# Altium schematic sheet ESP8266_Impedance.SchDoc
size A
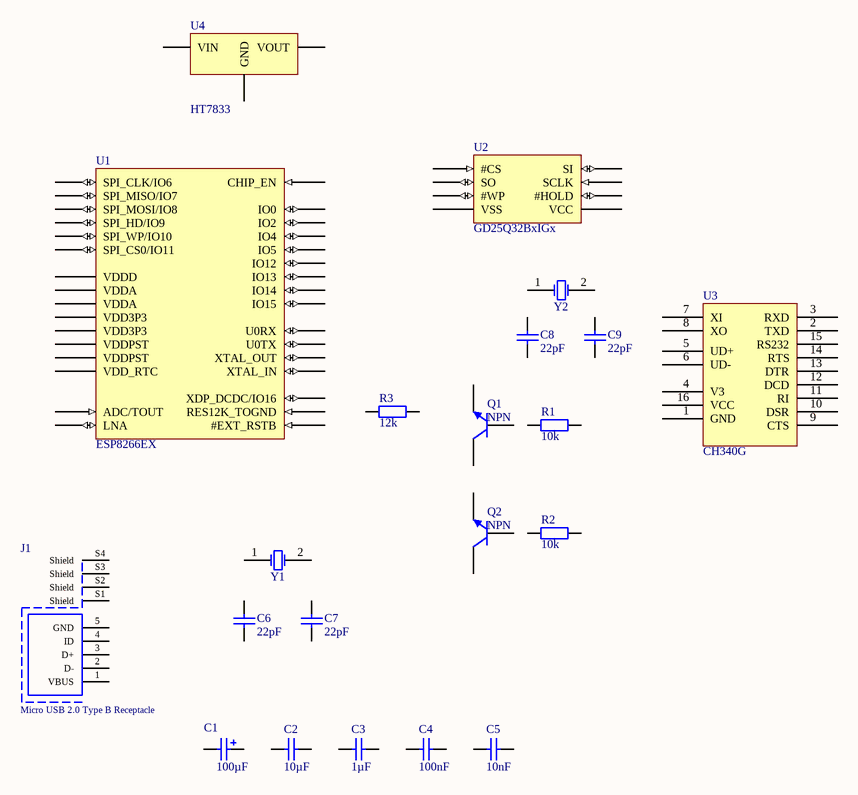
[diagram p0: ESP8266_Impedance.SchDoc]

## Parts
C1  100µF  [WCAP-ATG8_5x11]
C2  10µF  [WCAP-CSGP_0805_H=0.8mm_Reflow]
C3  1µF  [WCAP-CSGP_0805_H=0.8mm_Reflow]
C4  100nF  [WCAP-CSGP_0805_H=0.8mm_Reflow]
C5  10nF  [WCAP-CSGP_0805_H=0.8mm_Reflow]
C6  22pF  [WCAP-CSGP_0805_H=0.8mm_Reflow]
C7  22pF  [WCAP-CSGP_0805_H=0.8mm_Reflow]
C8  22pF  [WCAP-CSGP_0805_H=0.8mm_Reflow]
C9  22pF  [WCAP-CSGP_0805_H=0.8mm_Reflow]
J1  Micro USB 2.0 Type B Receptacle  [629105136821]
Q1  NPN  [SOT23P250X110-3N]
Q2  NPN  [SOT23P250X110-3N]
R1  10k  [WRIS-PSMB_0805_H=0.22mm]
R2  10k  [WRIS-PSMB_0805_H=0.22mm]
R3  12k  [WRIS-PSMB_0805_H=0.22mm]
U1  ESP8266EX  [ESP8266EX]
U2  GD25Q32BxIGx  [GD25Q32BxIGx]
U3  CH340G  [CH340G]
U4  HT7833  [HT7833]
Y1  24MHz  [WE-XTAL_HC49/4H]  (value not drawn)
Y2  12MHz  [WE-XTAL_HC49/4H]  (value not drawn)

## Nets

Not connected (* = marked no-connect by the designer): C1 1(N) 2(P); C2 1 2; C3 1 2; C4 1 2; C5 1 2; C6 1 2; C7 1 2; C8 1 2; C9 1 2; J1 1(VBUS) 2(D-) 3(D+) 4(ID) 5(GND) S1(Shield) S2(Shield) S3(Shield) S4(Shield); Q1 1(C) 2(B) 3(E); Q2 1(C) 2(B) 3(E); R1 1 2; R2 1 2; R3 1 2; U1 1(VDDA) 2(LNA) 3(VDD3P3) 4(VDD3P3) 5(VDD_RTC) 6(ADC/TOUT) 7(CHIP_EN) 8(XDP_DCDC/IO16) 9(IO14) 10(IO12) 11(VDDPST) 12(IO13) 13(IO15) 14(IO2) 15(IO0) 16(IO4) 17(VDDPST) 18(SPI_HD/IO9) 19(SPI_WP/IO10) 20(SPI_CS0/IO11) 21(SPI_CLK/IO6) 22(SPI_MISO/IO7) 23(SPI_MOSI/IO8) 24(IO5) 25(U0RX) 26(U0TX) 27(XTAL_OUT) 28(XTAL_IN) 29(VDDD) 30(VDDA) 31(RES12K_TOGND) 32(#EXT_RSTB); U2 1(#CS) 2(SO) 3(#WP) 4(VSS) 5(SI) 6(SCLK) 7(#HOLD) 8(VCC); U3 1(GND) 2(TXD) 3(RXD) 4(V3) 5(UD+) 6(UD-) 7(XI) 8(XO) 9(CTS) 10(DSR) 11(RI) 12(DCD) 13(DTR) 14(RTS) 15(RS232) 16(VCC); U4 1(GND) 2(VIN) 3(VOUT); Y1 1(OSC1) 2(OSC2); Y2 1(OSC1) 2(OSC2)

## Library data of the parts
C1 = 860010272005: WCAP-ATG8 THT Aluminum Electrolytic Capacitors, D5mm x L11mm, 100uF, +/-20%, 10VDC; Dissipation Factor: 19%; Endurance: 2000h; Leakage Current: 10uA; Ripple Current max.: 198mA; Technical Reference: ATBC110101M010DSPA3B000; ComponentLink1Description: Manufacturer; ComponentLink1URL: http://www.we-online.de; ComponentLink2Description: Datasheet; ComponentLink2URL: https://katalog.we-online.com/pbs/datasheet/860010272005.pdf; Length: 11mm; Mounting Technology: THT; Operating Temperature: -40 to +85degC; Packaging: Ammo Pack; Published Date: August 2019; Capacitance: 100uF; Diameter: 5mm; Part Number: 860010272005; Publisher: Wurth Elektronik; Capacitance Tolerance: +/-20%; Rated Voltage: 10VDC
C2-C9 = 885012007007: WCAP-CSGP General Purpose Ceramic Capacitors, size 0805, 470pF, +/-5%, 10VDC; Isolation Resistance: >=10GOhm; Ceramic Type: NP0; Dissipation Factor: Q>=1000; Technical Reference: NP00805471J010DFCT10000; ComponentLink1Description: Manufacturer; ComponentLink1URL: http://www.we-online.de; ComponentLink2Description: Datasheet; ComponentLink2URL: https://katalog.we-online.com/pbs/datasheet/885012007007.pdf; Operating Temperature: -55 to +125degC; Packaging: Tape and Reel; Part Number: 885012007007; Publisher: Wurth Elektronik; Rated Voltage: 10VDC; Published Date: August 2019; Capacitance Tolerance: +/-5%; Height: 0.8mm +/-0.10mm; Mounting Technology: SMD; Size: 0805; Capacitance: 470pF
J1 = 629105136821: Micro USB 2.0 Type B, Receptacle, Horizontal, SMT; Rated Current: 1A; Pin Number: 5; Interface Type: Type B; Working Voltage: 30VAC; ComponentLink1Description: Manufacturer; ComponentLink1URL: http://www.we-online.de; ComponentLink2Description: Datasheet; ComponentLink2URL: https://katalog.we-online.com/em/datasheet/629105136821.pdf; Published Date: September 2019; Publisher: Wurth Elektronik; Part Number: 629105136821; Gender: Receptacle; Type: Horizontal; Packaging: Tape and Reel; Operating Temperature: -40 to +105degC; Mounting Technology: SMT; Application: Micro USB 2.0
Q1 Q2 = NPN: NPN Bipolar Transistor; Published: 8-Jun-2000; LatestRevisionDate: 17-Jul-2002; LatestRevisionNote: Re-released for DXP Platform.; PackageReference: TO-226-AA; Publisher: Altium Limited; PackageDescription: TO, Flat Index; 3 In-Line, Axial Leads; Body Dia. 4.8mm; Leads 0.55 x 0.51 mm (max); Code_JEDEC: TO-226-AA
R1-R3 = 580060720008: WRIS-PSMB Metal Plate Resistors, size 0805, 10mOhm, +/-1%, 0.5W; Rated Current: 7.07A; Temperature Coefficient of Resistance: +/-100ppm/degC; Technical Reference: MB0805R010F102KAATP0000; ComponentLink1Description: Manufacturer; ComponentLink1URL: http://www.we-online.de; ComponentLink2Description: Datasheet; ComponentLink2URL: https://katalog.we-online.com/pbs/datasheet/580060720008.pdf; Publisher: Wurth Elektronik; Rated Power: 0.5W; Resistance: 10mOhm; Mounting Technology: SMT; Height: 0.22mm; Part Number: 580060720008; Packaging: Tape and Reel; Published Date: September 2019; Size: 0805; Length: 2mm; Operating Temperature: -55 to +155degC; Resistance Tolerance: +/-1%; Width: 1.25mm
Y1 Y2 = 830003224B: HC-49 24MHz; Frequency Stability: 50ppm; Load Capacitance: 30pF; Frequency Tolerance: +/-30ppm; Frequency: 14.7456MHz; ComponentLink1Description: Manufacturer; ComponentLink1URL: http://www.we-online.de; ComponentLink2Description: Datasheet; ComponentLink2URL: https://katalog.we-online.com/pbs/datasheet/830003224B.pdf; Part Number: 830003224B; Published Date: March 2019; Publisher: Wurth Elektronik; Size: HC49-4H; Operating Temperature: -10 up to +60degC; Mounting Technology: THT; Packaging: Bulk